# Altium schematic sheet STM32Camera.SchDoc
size Letter; SheetNumber: 1; SheetTotal: 1
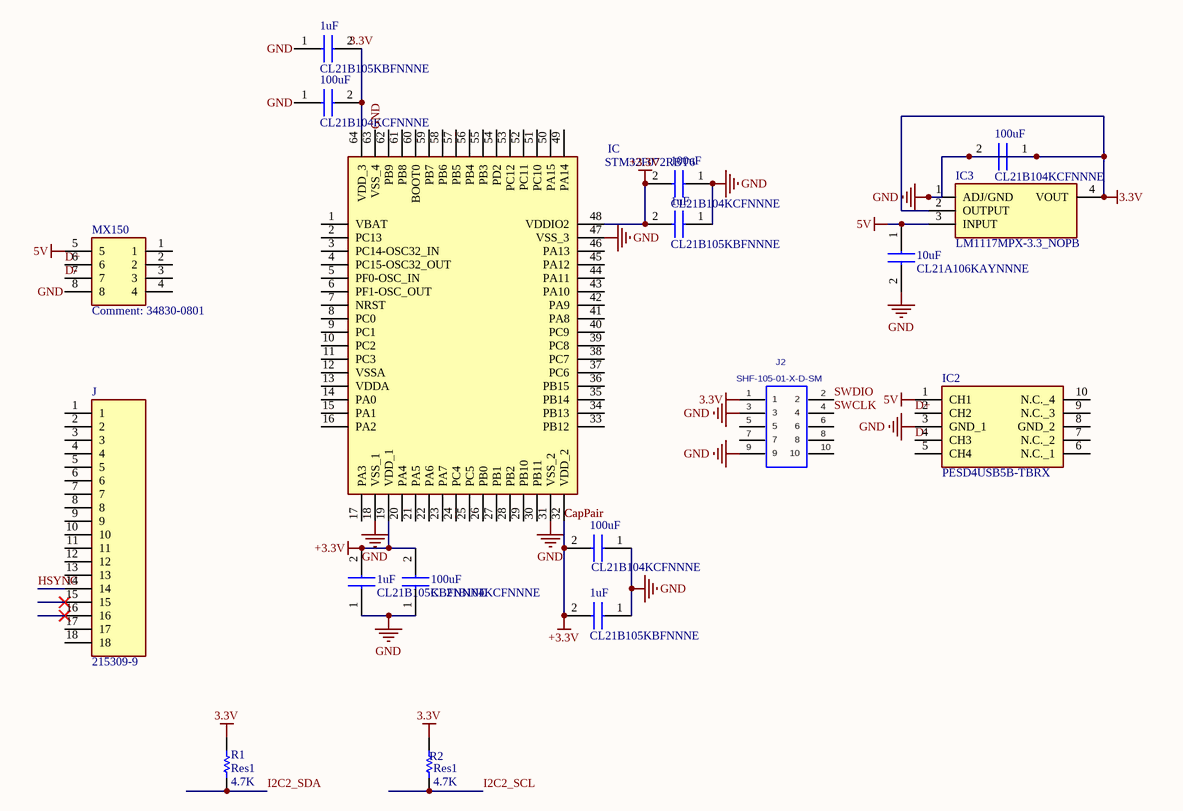
[diagram p0: STM32Camera.SchDoc]

## Parts
(Parts that share a designator on the sheet are numbered #1, #2 ... from top to bottom, then left to right.)
1uF#1  CL21B105KBFNNNE  [CAPC2012X135N]
1uF#2  CL21B105KBFNNNE  [CAPC2012X145N]
1uF#3  CL21B105KBFNNNE  [CAPC2012X135N]
1uF#4  CL21B105KBFNNNE  [CAPC2012X145N]
10uF  CL21A106KAYNNNE  [CAPC2012X145N]
100uF#1  CL21B104KCFNNNE  [CAPC2012X145N]
100uF#2  CL21B104KCFNNNE  [CAPC2012X135N]
100uF#3  CL21B104KCFNNNE  [CAPC2012X135N]
100uF#4  CL21B104KCFNNNE  [CAPC2012X135N]
100uF#5  CL21B104KCFNNNE  [CAPC2012X135N]
IC  STM32F072RBT6  [QFP50P1200X1200X160-64N]
IC2  PESD4USB5B-TBRX  [PESD4USB5BTBRX]
IC3  LM1117MPX-3.3_NOPB  [SOT230P700X180-4N]
J  215309-9  [TE_215309-9]
J2  SHF-105-01-X-D-SM  [SHF-105-01-X-D-SM]
MX150  34830-0801  [348300801]
R1  Res1  value 4.7K  [AXIAL-0.3]
R2  Res1  value 4.7K  [AXIAL-0.3]

## Nets
3.3V: 1uF#1.1 1uF#1.2 1uF#2.1 1uF#3.1 1uF#4.1 10uF.2 100uF#1.1 100uF#1.2 100uF#2.1 100uF#2.2 100uF#3.1 100uF#4.1 100uF#5.1 IC.18(VSS_1) IC.31(VSS_2) IC.47(VSS_3) IC.63(VSS_4) IC.64(VDD_3) IC2.3(GND_1) IC3.1(ADJ/GND) IC3.2(OUTPUT) IC3.4(VOUT) J2.1 J2.3 J2.9 MX150.8 R1.1 R2.1  [also labelled GND]
5V: 10uF.1 IC2.1(CH1) IC3.3(INPUT) MX150.5
CapPair: 1uF#2.2 1uF#3.2 1uF#4.2 100uF#3.2 100uF#4.2 100uF#5.2 IC.19(VDD_1) IC.32(VDD_2) IC.48(VDDIO2)  [also labelled +3.3V]
D+: IC2.2(CH2) MX150.6
D-: IC2.4(CH3) MX150.7
HSYNC: J.14
I2C2_SCL: R2.2
I2C2_SDA: R1.2
SWCLK: J2.4
SWDIO: J2.2

Not connected (* = marked no-connect by the designer): IC 1(VBAT) 2(PC13) 3(PC14-OSC32_IN) 4(PC15-OSC32_OUT) 5(PF0-OSC_IN) 6(PF1-OSC_OUT) 7(NRST) 8(PC0) 9(PC1) 10(PC2) 11(PC3) 12(VSSA) 13(VDDA) 14(PA0) 15(PA1) 16(PA2) 17(PA3) 20(PA4) 21(PA5) 22(PA6) 23(PA7) 24(PC4) 25(PC5) 26(PB0) 27(PB1) 28(PB2) 29(PB10) 30(PB11) 33(PB12) 34(PB13) 35(PB14) 36(PB15) 37(PC6) 38(PC7) 39(PC8) 40(PC9) 41(PA8) 42(PA9) 43(PA10) 44(PA11) 45(PA12) 46(PA13) 49(PA14) 50(PA15) 51(PC10) 52(PC11) 53(PC12) 54(PD2) 55(PB3) 56(PB4) 57(PB5) 58(PB6) 59(PB7) 60(BOOT0) 61(PB8) 62(PB9); IC2 5(CH4) 6(N.C._1) 7(N.C._2) 8(GND_2) 9(N.C._3) 10(N.C._4); J 1 2 3 4 5 6 7 8 9 10 11 12 13 15* 16* 17 18; J2 5 6 7 8 10; MX150 1 2 3 4

## Library data of the parts
1uF#1-1uF#4 = CL21B105KBFNNNE: Capacitor; Manufacturer_Name: Samsung Electro-Mechanics; Datasheet Link: https://componentsearchengine.com/Datasheets/2/CL21B105KBFNNNE.pdf; Height: 1.35mm; Manufacturer_Part_Number: CL21B105KBFNNNE; Mouser Part Number: 187-CL21B105KBFNNNE; Mouser Price/Stock: https://www.mouser.co.uk/ProductDetail/Samsung-Electro-Mechanics/CL21B105KBFNNNE?qs=yOVawPpwOwmddQEBPU6Y9A%3D%3D; Arrow Part Number: CL21B105KBFNNNE; Arrow Price/Stock: https://www.arrow.com/en/products/cl21b105kbfnnne/samsung-electro-mechanics?region=europe
10uF = CL21A106KAYNNNE: Capacitor; Manufacturer_Name: Samsung Electro-Mechanics; Datasheet Link: https://datasheet.datasheetarchive.com/originals/distributors/Datasheets_SAMA/6a45835c9b7400e9b49c55c38a8ff4a2.pdf; Height: 1.45mm; Manufacturer_Part_Number: CL21A106KAYNNNE; Mouser Part Number: 187-CL21A106KAYNNNE; Mouser Price/Stock: https://www.mouser.co.uk/ProductDetail/Samsung-Electro-Mechanics/CL21A106KAYNNNE?qs=yOVawPpwOwmTXAd4dJtNjA%3D%3D; Arrow Part Number: CL21A106KAYNNNE; Arrow Price/Stock: https://www.arrow.com/en/products/cl21a106kaynnne/samsung-electro-mechanics?region=nac
100uF#1-100uF#5 = CL21B104KCFNNNE: Capacitor; Manufacturer_Name: Samsung Electro-Mechanics; Datasheet Link: https://datasheet.datasheetarchive.com/originals/distributors/DKDS-19/374389.pdf; Height: 1.35mm; Manufacturer_Part_Number: CL21B104KCFNNNE; Mouser Part Number: 187-CL21B104KCFNNNE; Mouser Price/Stock: https://www.mouser.co.uk/ProductDetail/Samsung-Electro-Mechanics/CL21B104KCFNNNE?qs=lptGheUA4EwiEGVRX9oguw%3D%3D; Arrow Part Number: CL21B104KCFNNNE; Arrow Price/Stock: https://www.arrow.com/en/products/cl21b104kcfnnne/samsung-electro-mechanics
IC = STM32F072RBT6: Integrated Circuit; Manufacturer_Name: STMicroelectronics; Datasheet Link: http://www.st.com/st-web-ui/static/active/en/resource/technical/document/datasheet/DM00090510.pdf; Height: 1.6mm; Manufacturer_Part_Number: STM32F072RBT6; Mouser Part Number: 511-STM32F072RBT6; Mouser Price/Stock: https://www.mouser.co.uk/ProductDetail/STMicroelectronics/STM32F072RBT6?qs=xf9JV0PLFEcuk6sTlnutaw%3D%3D; Arrow Part Number: STM32F072RBT6; Arrow Price/Stock: https://www.arrow.com/en/products/stm32f072rbt6/stmicroelectronics
IC2 = PESD4USB5B-TBRX: Integrated Circuit; Manufacturer_Name: Nexperia; Datasheet Link: https://assets.nexperia.com/documents/data-sheet/PESD4USB5B-TBS.pdf; Height: 0.8mm; Manufacturer_Part_Number: PESD4USB5B-TBRX; Mouser Part Number: 771-PESD4USB5B-TBRX; Mouser Price/Stock: https://www.mouser.co.uk/ProductDetail/Nexperia/PESD4USB5B-TBRX?qs=MyNHzdoqoQL1Wz6R0ceOBw%3D%3D
IC3 = LM1117MPX-3.3_NOPB: Integrated Circuit; Manufacturer_Name: Texas Instruments; Manufacturer_Part_Number: LM1117MPX-3.3/NOPB; Datasheet Link: http://www.ti.com/lit/ds/symlink/lm1117.pdf; Height: 1.8mm; Mouser Part Number: 926-LM1117MPX3.3NOPB; Mouser Price/Stock: https://www.mouser.co.uk/ProductDetail/Texas-Instruments/LM1117MPX-3.3-NOPB?qs=X1J7HmVL2ZHRbBIxXi4utg%3D%3D; Arrow Part Number: LM1117MPX-3.3/NOPB; Arrow Price/Stock: https://www.arrow.com/en/products/lm1117mpx-3.3nopb/texas-instruments?region=nac
J = 215309-9: 2X9P HV100 REC CON. TE, 8.5MM; Number_of_Positions: 9; Centerline_Pitch: 2.54 mm[.1 in]; MF: TE Connectivity; Product_Type: Connector; Package: None; Availability: Unavailable; TE_purchase_URL: https://www.te.com/usa-en/product-215309-9.html?te_bu=Cor&te_type=disp&te_campaign=seda_glo_cor-seda-global-disp-prtnr-fy19-seda-model-bom-cta_sma-317_1&elqCampaignId=32493; EU_RoHS_Compliance: Compliant; MP: 215309-9; SnapEDA_Link: https://www.snapeda.com/parts/215309-9/TE%20Connectivity%20AMP%20Connectors/view-part/1389782/?ref=snap; Price: None; Value: *
J2 = SHF-105-01-X-D-SM: 0.05"X0.05" SHROUDED TERMINAL STRIP, 10 PINS.; MANUFACTURER: SAMTEC; CREATED: February 17, 2015 - Wendy Xin; PCB DECAL: SHF-105-01-X-D-SM
MX150 = 34830-0801: Connector; Manufacturer_Name: Molex; Datasheet Link: https://www.mouser.com/datasheet/2/276/0348300801_PCB_HEADERS-693677.pdf; Height: 25.88mm; Manufacturer_Part_Number: 34830-0801; Mouser Part Number: 538-34830-0801; Mouser Price/Stock: https://www.mouser.co.uk/ProductDetail/Molex/34830-0801?qs=PdnAIJ6Mlf2HM0lerKt%252BjA%3D%3D
R1 R2 = Res1: Resistor; Published: 8-Jun-2000; LatestRevisionDate: 17-Jul-2002; LatestRevisionNote: Re-released for DXP Platform.; PackageReference: AXIAL-0.3; Publisher: Altium Limited; PackageDescription: Axial Device, Thru-Hole; 2 Leads; 0.3 in Pin Spacing